# EAGLE design extCAN (EAGLE 4.16)
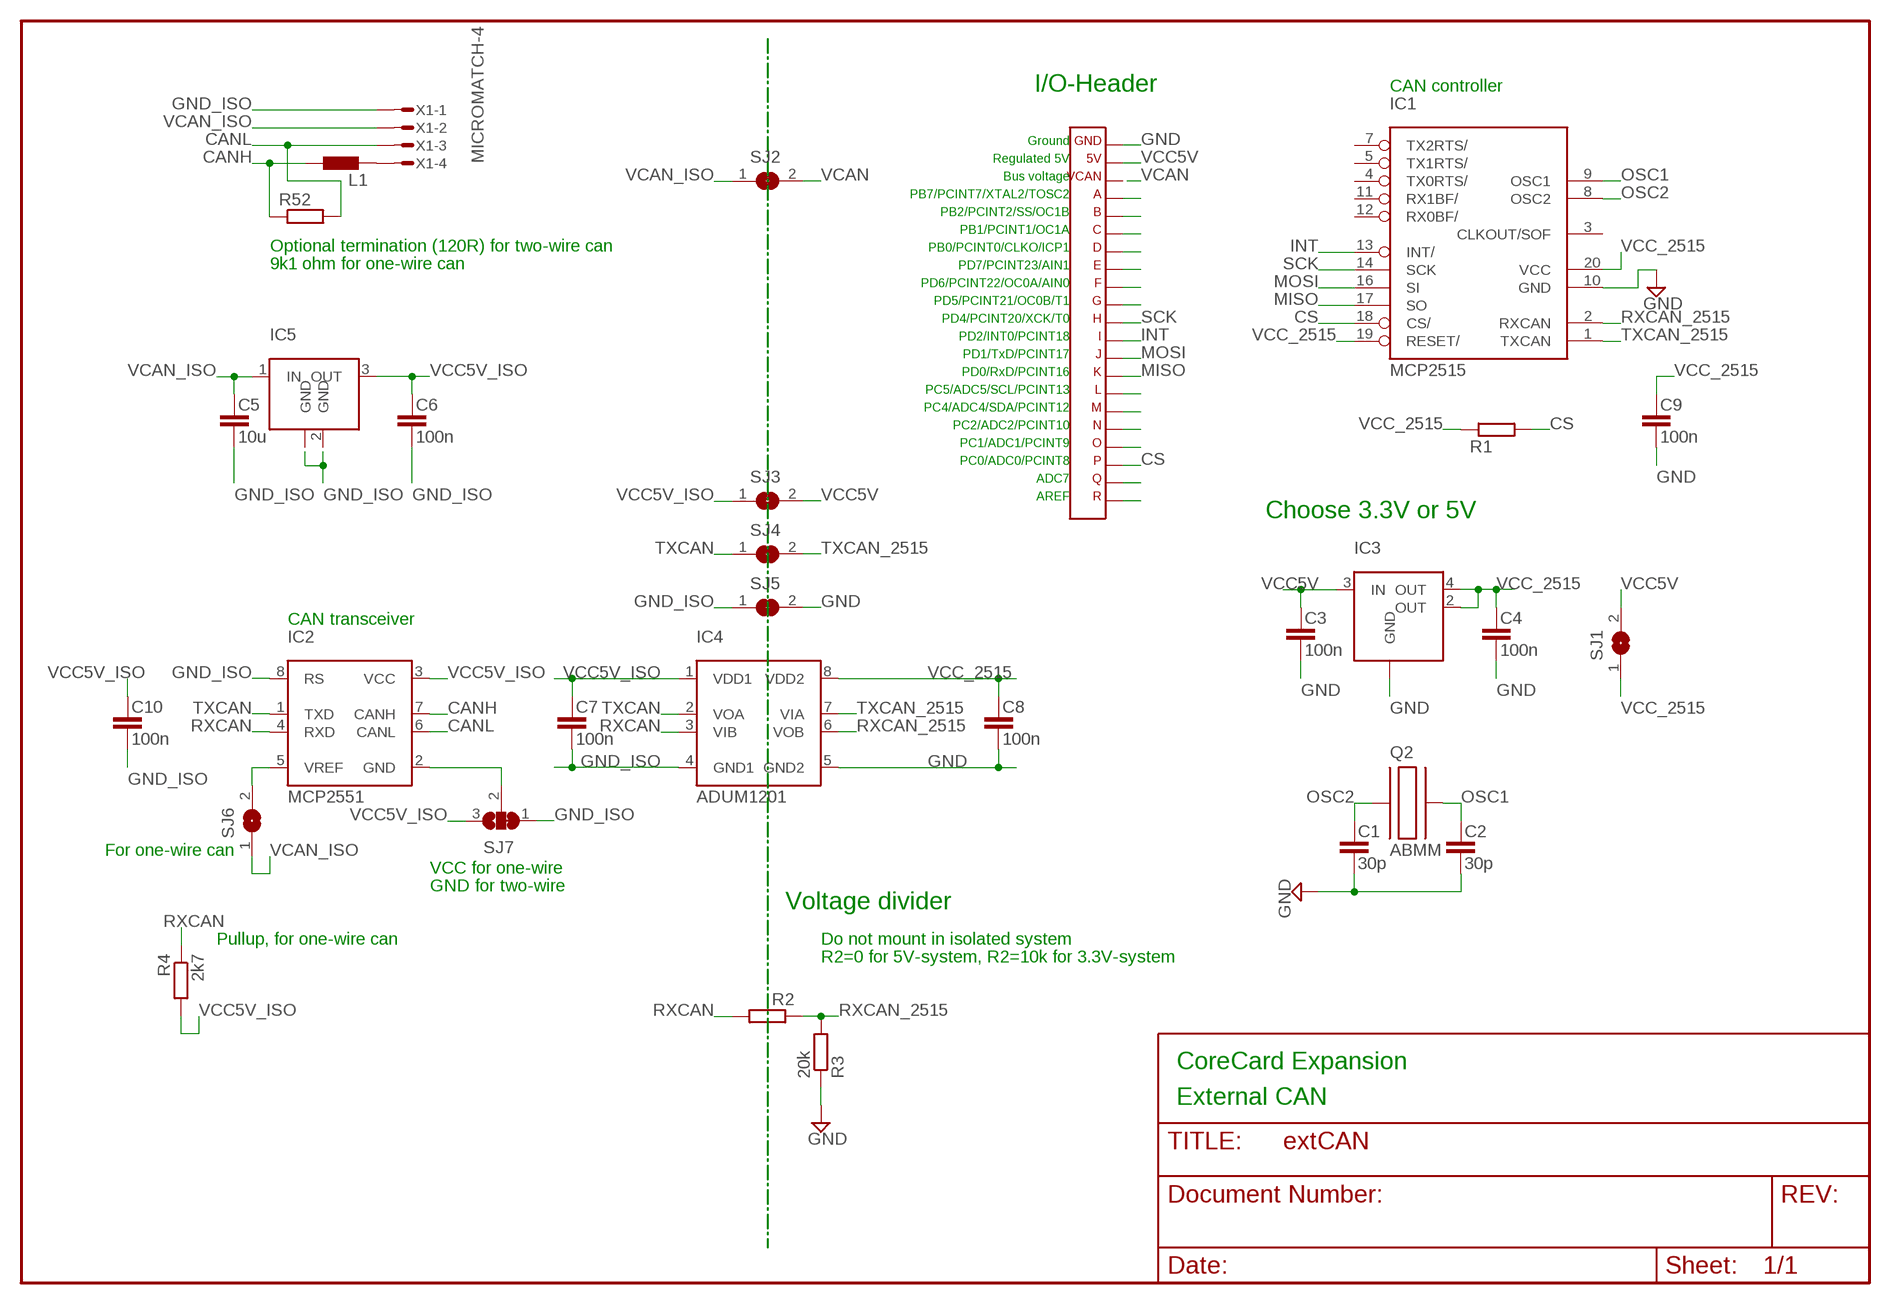
[diagram p0: schematic, sheet 1]

## Parts
C1  30p  C-EUC0603  [C0603]
C2  30p  C-EUC0603  [C0603]
C3  100n  C-EUC0603  [C0603]
C4  100n  C-EUC0603  [C0603]
C5  10u  C-EUC1210  [C1210]
C6  100n  C-EUC0603  [C0603]
C7  100n  C-EUC0603  [C0603]
C8  100n  C-EUC0603  [C0603]
C9  100n  C-EUC0603  [C0603]
C10  100n  C-EUC0603  [C0603]
IC1  MCP2515  [TSSOP]
IC2  MCP2551  [SOIC]
IC3  LM1117MP-3.3  [SOT223]
IC4  ADUM1201  [SOIC]
IC5  LM340MP-5.0  [SOT223]
L1  L-EUL1812  [L1812]
Q2  ABMM  [SMD]
R1  R-EUR0603  [R0603]
R2  R-EUR0603  [R0603]
R3  20k  R-EUR0603  [R0603]
R4  2k7  R-EUR0603  [R0603]
R52  R-EUR0603  [R0603]
SJ1  SJ_NO  [SJ_NO]
SJ2  SJ_NO  [SJ_NO]
SJ3  SJ_NO  [SJ_NO]
SJ4  SJ_NO  [SJ_NO]
SJ5  SJ_NO  [SJ_NO]
SJ6  SJ_NO  [SJ_NO]
SJ7  SJ_2_NO_NCSMALL  [SJ_2_NO_NC_SMALL]
X1  MICROMATCH-4  [MICROMATCH-4]
X3  CORE_IOHEADEXP  [CORE_IOHEAD_NOSILC]

## Nets
CANH: IC2.7(CANH) L1.2 R52.1
CANL: IC2.6(CANL) R52.2 X1.3
CS: IC1.18(CS/) R1.2 X3.19
EXP_A: X3.4
EXP_B: X3.5
EXP_C: X3.6
EXP_D: X3.7
EXP_E: X3.8
EXP_F: X3.9
EXP_G: X3.10
EXP_L: X3.15
EXP_M: X3.16
EXP_N: X3.17
EXP_O: X3.18
EXP_Q: X3.20
EXP_R: X3.21
GND: C1.2 C2.2 C3.2 C4.2 C8.2 C9.2 IC1.10(GND) IC3.1(GND) IC4.5(GND2) R3.1 SJ5.2 X3.1
GND_ISO: C5.2 C6.2 C7.2 C10.2 IC2.8(RS) IC4.4(GND1) IC5.2(GND) IC5.4(GND) SJ5.1 SJ7.1 X1.1
GND_OR_VCC: IC2.2(GND) SJ7.2
INT: IC1.13(INT/) X3.12
MISO: IC1.17(SO) X3.14
MOSI: IC1.16(SI) X3.13
N$2: IC2.5(VREF) SJ6.2
N$3: L1.1 X1.4
OSC1: C2.1 IC1.9(OSC1) Q2.2
OSC2: C1.1 IC1.8(OSC2) Q2.1
RXCAN: IC2.4(RXD) IC4.3(VIB) R2.2 R4.1
RXCAN_2515: IC1.2(RXCAN) IC4.6(VOB) R2.1 R3.2
SCK: IC1.14(SCK) X3.11
TXCAN: IC2.1(TXD) IC4.2(VOA) SJ4.1
TXCAN_2515: IC1.1(TXCAN) IC4.7(VIA) SJ4.2
VCAN: SJ2.2 X3.3
VCAN_ISO: C5.1 IC5.1(IN) SJ2.1 SJ6.1 X1.2
VCC5V: C3.1 IC3.3(IN) SJ1.2 SJ3.2 X3.2
VCC5V_ISO: C6.1 C7.1 C10.1 IC2.3(VCC) IC4.1(VDD1) IC5.3(OUT) R4.2 SJ3.1 SJ7.3
VCC_2515: C4.1 C8.1 C9.1 IC1.19(RESET/) IC1.20(VCC) IC3.2(OUT) IC3.4(OUT) IC4.8(VDD2) R1.1 SJ1.1
Unconnected: IC1.3(CLKOUT/SOF) IC1.4(TX0RTS/) IC1.5(TX1RTS/) IC1.7(TX2RTS/) IC1.11(RX1BF/) IC1.12(RX0BF/)

## Notes on the sheet
- I/O-Header | CAN controller
- Ground
- Regulated 5V
- Bus voltage
- PB7/PCINT7/XTAL2/TOSC2
- PB2/PCINT2/SS/OC1B
- PB1/PCINT1/OC1A
- Optional termination (120R) for two-wire can | PB0/PCINT0/CLKO/ICP1
- 9k1 ohm for one-wire can | PD7/PCINT23/AIN1
- PD6/PCINT22/OC0A/AIN0
- PD5/PCINT21/OC0B/T1
- PD4/PCINT20/XCK/T0
- PD2/INT0/PCINT18
- PD1/TxD/PCINT17
- PD0/RxD/PCINT16
- PC5/ADC5/SCL/PCINT13
- PC4/ADC4/SDA/PCINT12
- PC2/ADC2/PCINT10
- PC1/ADC1/PCINT9
- PC0/ADC0/PCINT8
- ADC7
- AREF
- Choose 3.3V or 5V
- CAN transceiver
- For one-wire can
- VCC for one-wire
- GND for two-wire
- Voltage divider
- Pullup, for one-wire can | Do not mount in isolated system
- R2=0 for 5V-system, R2=10k for 3.3V-system
- CoreCard Expansion
- External CAN

## Power pins joined to a net without a drawn wire
GND: Q2.GND@0(GND) Q2.GND@1(GND)

## Library data of the parts
C1-C10 = rcl:C-EU
IC1 = mcp2515:MCP2515
IC2 = mcp2551:MCP2551
IC3 = lm1117mp:LM1117MP-3.3
IC4 = adum1201:ADUM1201
IC5 = lm340mp:LM340MP-5.0
L1 = rcl:L-EU
Q2 = abmm:ABMM
R1-R4 R52 = rcl:R-EU
SJ1-SJ6 = jumper:SJ_NO
SJ7 = jumper:SJ_2_NO_NC
X1 = con-amp-micromatch:MICROMATCH-4: MicroMaTch 4 7-215464-4 / 0-215464-4 Drawing Number C-215464 DDEController.pdf
X3 = expboard:CORE_IOHEAD: CoreCard IO-header for expansion cards

## Board
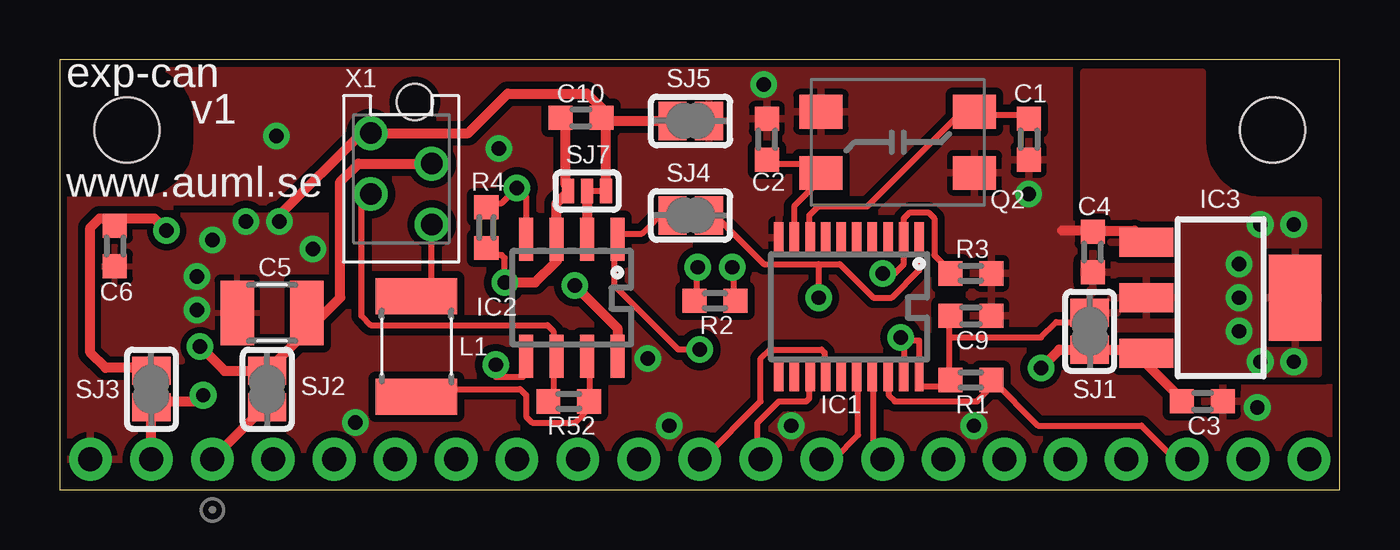
[diagram p1: board, top side]
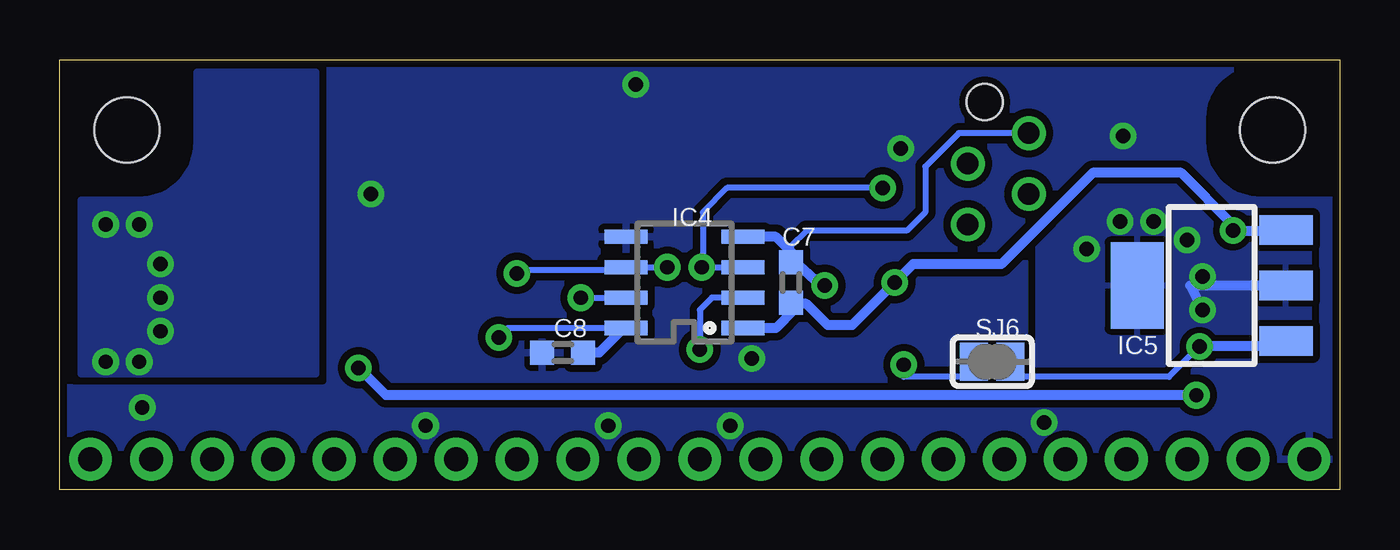
[diagram p2: board, bottom side, seen from below]

Size 53.34 x 17.91 mm. Coordinates in mm from the lower left corner, seen from the top.
Outline: 0,0 53.34,0 53.34,17.91 0,17.91 0,0
Copper layers (1*16): Top 0.035mm / dielectric 1.5mm / Bottom 0.035mm
Design rules "default": minimum track width 10mil, minimum drill 0.4mm, track to track 10mil, track to pad 10mil, pad to pad 10mil, via to via 10mil, smd to smd 8mil, copper to edge 10mil, drill to drill 8mil, minimum pad ring 10mil, minimum via ring 10mil, stop-mask expansion 4mil, vias tented up to drill 18mil, thermal gap 10mil
Holes 2.7 mm at 50.55,14.99 2.79,14.99

### Footprints (pad centres in the part's own frame; a part is rotated, then mirrored left to right if it is on the bottom)
C0603 = smd 1 x 1: 1 -0.85,0; 2 0.85,0
C1210 = smd 1.4 x 2.7: 1 -1.4,0; 2 1.5,0
TSSOP = smd 0.396 x 1.3: 1 -2.925,-2.875; 2 -2.275,-2.875; 3 -1.625,-2.875; 4 -0.975,-2.875; 5 -0.325,-2.875; 6 0.325,-2.875; 7 0.975,-2.875; 8 1.625,-2.875; 9 2.275,-2.875; 10 2.925,-2.875; 11 2.925,2.875; 12 2.275,2.875; 13 1.625,2.875; 14 0.975,2.875; 15 0.325,2.875; 16 -0.325,2.875; 17 -0.975,2.875; 18 -1.625,2.875; 19 -2.275,2.875 | smd 0.369 x 1.3: 20 -2.925,2.875
SOIC = smd 0.6 x 1.8: 1 -1.905,-2.44; 2 -0.635,-2.44; 3 0.635,-2.44; 4 1.905,-2.44; 5 1.905,2.44; 6 0.635,2.44; 7 -0.635,2.44; 8 -1.905,2.44
SOT223 = smd 1.219 x 2.235: 1 -2.311,-3.099; 2 0,-3.099; 3 2.311,-3.099 | smd 3.6 x 2.2: 4 0,3.099
L1812 = smd 1.5 x 3.4: 1 -2.1,0; 2 2.1,0
SMD = smd 1.8 x 1.4: 1 -3.2,-1.4; 2 3.2,1.15; GND@0 -3.2,1.15; GND@1 3.2,-1.4
R0603 = smd 0.991 x 1.016: 1 -0.85,0; 2 0.85,0
SJ_NO = smd 1.168 x 1.6: 1 -0.762,0; 2 0.762,0
SJ_2_NO_NC_SMALL = smd 0.508 x 1.016: 1 -0.787,0; 2 0,0; 3 0.787,0
MICROMATCH-4 = drill 0.9 round: 1 1.905,1.27; 2 0.635,-1.27; 3 -0.635,1.27; 4 -1.905,-1.27 | hole 1.5: 3.199,-0.562
CORE_IOHEAD_NOSILC = drill 1 pad 1.778 round: 1 25.4,0; 2 22.86,0; 3 20.32,0; 4 17.78,0; 5 15.24,0; 6 12.7,0; 7 10.16,0; 8 7.62,0; 9 5.08,0; 10 2.54,0; 11 0,0; 12 -2.54,0; 13 -5.08,0; 14 -7.62,0; 15 -10.16,0; 16 -12.7,0; 17 -15.24,0; 18 -17.78,0; 19 -20.32,0; 20 -22.86,0; 21 -25.4,0

### Placement (x,y rotation side)
C1  40.39,14.61 270 top
C2  29.46,14.61 90 top
C3  47.62,3.68 0 top
C4  43.05,9.91 90 top
C5  8.89,7.37 180 top
C6  2.29,10.16 270 top
C7  22.86,8.64 90 bottom
C8  32.38,5.71 180 bottom
C9  37.97,7.24 0 top
C10  21.72,15.49 0 top
IC1  32.89,7.62 180 top
IC2  21.34,8 180 top
IC3  48.39,8 270 top
IC4  27.3,8.64 90 bottom
IC5  5.33,8.51 90 bottom
L1  14.86,5.97 270 top
Q2  34.92,14.35 180 top
R1  37.97,4.57 0 top
R2  27.3,7.87 180 top
R3  37.97,9.02 180 top
R4  17.78,10.92 270 top
R52  21.21,3.68 180 top
SJ1  42.93,6.6 270 top
SJ2  8.64,4.19 270 top
SJ3  3.81,4.19 270 top
SJ4  26.29,11.43 0 top
SJ5  26.29,15.37 0 top
SJ6  14.48,5.33 180 bottom
SJ7  21.97,12.45 180 top
X1  14.22,12.95 90 top
X3  26.67,1.27 0 bottom

### Tracks (layer width: path | path; a pad name or v marks a point on that pad's centre or on a via)
CANH
  Top 0.254: IC2.7 22.1,5.56 22.1,3.68 R52.1 22.06,3.47 22.1,3.43 21.46,2.79 19.68,2.79 19.43,3.05 19.43,3.94 19.18,4.19 16.51,4.19 16.19,3.87 L1.2
CANL
  Top 0.254: R52.2 20.57,3.68 20.57,5.56 IC2.6 20.7,5.59 20.57,5.59 20.57,6.6 20.32,6.86 12.95,6.86 12.57,7.24 12.57,11.94 X1.3
CS
  Top 0.254: IC1.18 34.52,4.72 34.54,4.7 34.54,3.94 34.8,3.68 38.23,3.68 38.61,4.06 38.61,4.32 38.82,4.53 R1.2 38.86,4.57 40.77,2.67 45.09,2.67 46.48,1.27 X3.19
GND  (via drill 0.6)
  Top 0.406: IC3.1 44.81,10.79 43.05,10.79 C4.2 43.01,10.79 41.78,10.79
  other vias: 30.48,2.67 38.1,2.67 18.29,14.22 24.51,5.46 49.91,3.43 25.4,2.67 12.32,2.79 9.02,14.73 40.39,12.32 29.34,16.89
  pour Bottom (isolate 0.305, rank 3): 0,17.91 53.34,17.91 53.34,17.78 50.04,17.78 arc90 47.62,15.49 47.62,14.48 arc90 50.04,12.06 53.34,12.06 53.34,1.14 0,1.14 0,12.06 3.3,12.06 arc90 5.71,14.48 5.71,15.49 arc90 3.43,17.78 0,17.78
  pour Top (isolate 0.305, rank 3): 0,17.91 53.34,17.91 53.34,17.78 50.04,17.78 arc90 47.62,15.49 47.62,14.48 arc90 50.04,12.06 53.34,12.06 53.34,1.14 0,1.14 0,12.06 3.3,12.06 arc90 5.71,14.48 5.71,15.49 arc90 3.43,17.78 0,17.78
GND_ISO  (via drill 0.6)
  Top 0.406: IC2.8 23.24,6.73 v21.46,8.51 | SJ7.1 22.76,12.68 22.73,12.7 22.73,15.24 | 22.73,15.24 22.44,15.53 C10.2 22.44,15.41 22.48,15.37 SJ5.1 | 22.73,15.24 22.73,15.75 21.97,16.51 18.67,16.51 17.02,14.86 X1.1 12.57,14.86 9.14,11.43 v9.14,11.18
  Bottom 0.254: 22.86,9.91 22.86,10.16 22.23,10.79 18.03,10.79 17.27,11.56 17.27,13.46 15.88,14.86 X1.1
  Bottom 0.406: 22.86,9.91 C7.2 | IC4.4 23.5,10.54 22.86,9.91 | v21.46,8.51 21.46,8.38 22.73,9.53 22.86,9.91 | IC5.2 6.22,8.51 v5.71,7.49
  other vias: 7.75,11.18 10.54,10.03 6.35,10.41 5.71,8.89
  pour Bottom (isolate 0.254): 6.35,12.95 10.54,12.95 12.57,10.92 12.57,4.7 6.48,4.7 5.21,5.97 1.27,5.97 1.27,10.67 4.06,10.67
  pour Top (isolate 0.254): 1.52,11.43 11.56,11.43 11.56,6.6 6.35,6.6 5.08,5.33 1.52,5.33
GND_OR_VCC
  Top 0.406: SJ7.2 IC2.2
INT
  Top 0.254: IC1.13 31.27,4.72 31.24,4.7 31.24,3.81 31.11,3.68 29.97,3.68 29.08,2.79 29.08,1.4 X3.12
MISO
  Top 0.254: IC1.17 33.91,4.75 33.91,1.27 X3.14
MOSI
  Top 0.254: IC1.16 33.27,4.75 33.27,2.29 32.26,1.27 X3.13
N$2  (via drill 0.6)
  Top 0.254: IC2.5 19.3,5.56 19.3,4.7 18.16,4.7 v18.16,5.21
  Bottom 0.254: v18.16,5.21 18.16,4.7 15.24,4.7 SJ6.2
N$3
  Top 0.254: L1.1 15.24,8.26 15.49,8.51 X1.4
OSC1
  Top 0.254: C2.1 29.59,13.72 29.34,13.59 30.86,13.59 31.24,13.21 31.23,13.2 Q2.2 31.73,12.93 30.61,11.81 30.61,10.67 30.62,10.66 IC1.9
OSC2
  Top 0.254: C1.1 40.42,15.46 40.26,15.62 38.35,15.62 38.22,15.75 Q2.1 38.1,15.75 37.97,15.62 37.47,15.62 33.66,11.81 31.62,11.81 31.24,11.43 31.24,10.92 31.27,10.9 IC1.8
RXCAN  (via drill 0.6)
  Top 0.254: R2.2 26.42,7.87 26.54,8 26.54,9.27 v26.59,9.27 | IC2.4 19.43,12.19 v19.05,12.57 18.41,11.94 18.03,11.94 17.87,11.77 R4.1
  Bottom 0.254: IC4.3 v26.59,9.27 26.54,9.27 26.54,11.56 25.53,12.57 v19.05,12.57
RXCAN_2515  (via drill 0.6)
  Top 0.254: R2.1 28.19,7.87 28.07,8 28.07,9.27 v28.02,9.27 | R3.2 36.96,9.18 36.96,9.27 36.45,9.78 36.45,11.3 36.2,11.56 35.43,11.56 35.18,11.3 IC1.2 35.17,10.3 35.18,10.29 35.18,9.4 34.8,9.02 v34.29,9.02
  Bottom 0.254: v28.02,9.27 IC4.6 29.72,9.24 29.72,9.14 34.16,9.14 v34.29,9.02
SCK
  Top 0.254: IC1.14 31.92,4.91 31.88,4.95 31.88,5.71 31.75,5.84 29.59,5.84 29.21,5.46 29.21,3.68 26.8,1.27 X3.11
TXCAN  (via drill 0.6)
  Top 0.254: v26.67,5.84 25.78,5.84 23.11,8.51 23.11,10.29 23.24,10.41 IC2.1 23.37,10.67 24.26,10.67 25.27,11.68 SJ4.1
  Bottom 0.254: IC4.2 26.16,8 26.67,7.49 v26.67,5.84
TXCAN_2515  (via drill 0.6)
  Top 0.254: SJ4.2 27.3,11.81 27.43,11.68 27.43,11.3 29.34,9.4 31.62,9.4 | 31.62,9.4 v31.62,8 | IC1.1 35.81,10.54 | IC1.1 | IC1.1 35.81,9.14 34.67,8 33.91,8 32.51,9.4 31.62,9.4
  Bottom 0.254: v31.62,8 IC4.7
VCAN
  Top 0.406: SJ2.2 8.64,3.3 8.38,3.3 X3.3
VCAN_ISO  (via drill 0.6)
  Top 0.406: X1.2 12.45,13.59 11.68,12.83 11.68,8 10.16,6.48 | 10.16,6.48 10.16,7.11 10.29,7.24 C5.1 | 10.16,6.48 SJ2.1 6.86,4.95 v5.84,5.97
  Bottom 0.254: SJ6.1 13.34,5.33 13.34,4.7 7.11,4.7 v5.84,5.97
  Bottom 0.406: IC5.1 2.26,6.2 2.29,6.22 2.54,5.97 v5.84,5.97
VCC5V  (via drill 0.6)
  Top 0.406: X3.2 SJ3.2 4.06,3.68 5.71,3.68 v5.97,3.94 | C3.1 46.61,3.85 46.61,3.94 45.21,5.33 45.21,5.61 IC3.3 45.14,5.84 SJ1.2 41.66,5.84 v40.89,5.08
  Bottom 0.406: v40.89,5.08 39.75,3.94 v5.97,3.94
VCC5V_ISO  (via drill 0.6)
  Top 0.254: R4.2 17.78,10.03 18.03,9.78 18.41,9.78 18.54,9.65 v18.54,8.64
  Top 0.406: SJ3.1 3.94,5.08 1.91,5.08 1.27,5.71 1.27,10.92 1.65,11.3 2.41,11.3 | v18.54,8.64 19.81,8.64 20.7,9.53 IC2.3 20.7,11.94 21.21,12.45 SJ7.3 21.18,12.55 21.21,12.57 21.08,12.7 21.08,15.24 20.83,15.49 C10.1 | 2.41,11.3 3.94,11.3 v4.45,10.79 | C6.1 2.37,11.26 2.41,11.3
  Bottom 0.406: 24.89,6.73 IC4.1 23.5,6.73 22.73,7.49 C7.1 22.64,7.79 22.73,7.75 22.23,7.75 21.34,6.86 20.32,6.86 v18.54,8.64 17.78,9.4 14.1,9.4 10.29,13.21 6.6,13.21 4.45,11.05 v4.45,10.79 2.29,10.79 2.26,10.82 IC5.3
VCC_2515  (via drill 0.6)
  Top 0.254: 35.81,4.32 35.82,4.7 IC1.20 35.82,4.32 35.81,4.32 | 35.81,4.32 36.83,4.32 36.96,4.57 R1.1 37.12,4.66 37.08,4.7 37.08,6.35 | 35.81,4.32 35.81,6.22 35.18,6.22 | IC1.19 35.17,4.71 35.18,4.7 35.18,6.22 | C9.1 37.08,7.11 37.08,6.35 | v35.05,6.35 35.18,6.22 | SJ1.1 42.55,6.99 41.53,6.99 40.89,6.35 37.08,6.35
  Bottom 0.254: IC4.8 29.72,6.73 | v35.05,6.35 34.67,6.73 29.84,6.73
  Bottom 0.406: 29.72,6.7 IC4.8 29.84,6.73 30.86,5.71 C8.1
  other vias: 51.44,11.05 50.04,11.05 49.15,9.4 49.15,8 49.15,6.6 50.04,5.33 51.44,5.33
  pour Top: 42.67,4.83 52.45,4.83 52.45,12.06 50.04,12.06 arc-90 47.62,14.48 47.62,17.4 42.67,17.4
  pour Bottom: 42.67,17.4 47.62,17.4 47.62,14.48 arc90 50.04,12.06 52.45,12.06 52.45,4.83 42.67,4.83

### Text on the board
tPlace: exp-can | v1 | www.auml.se
Document: Top is component side | Expansion will be mounted bottom to bottom with CoreCard | Change vertical dimension to fit | Remove I/O-header silcscreen if neccesary | Remove mounting holes if neccesary
tDocu: - | + | A | B | C | D | E | F | G | H | I | J | K | L | M | N | O | P | Q | R